# Altium schematic sheet SCH_Smart_Door.SchDoc
size B; SheetNumber: 1; SheetTotal: 1
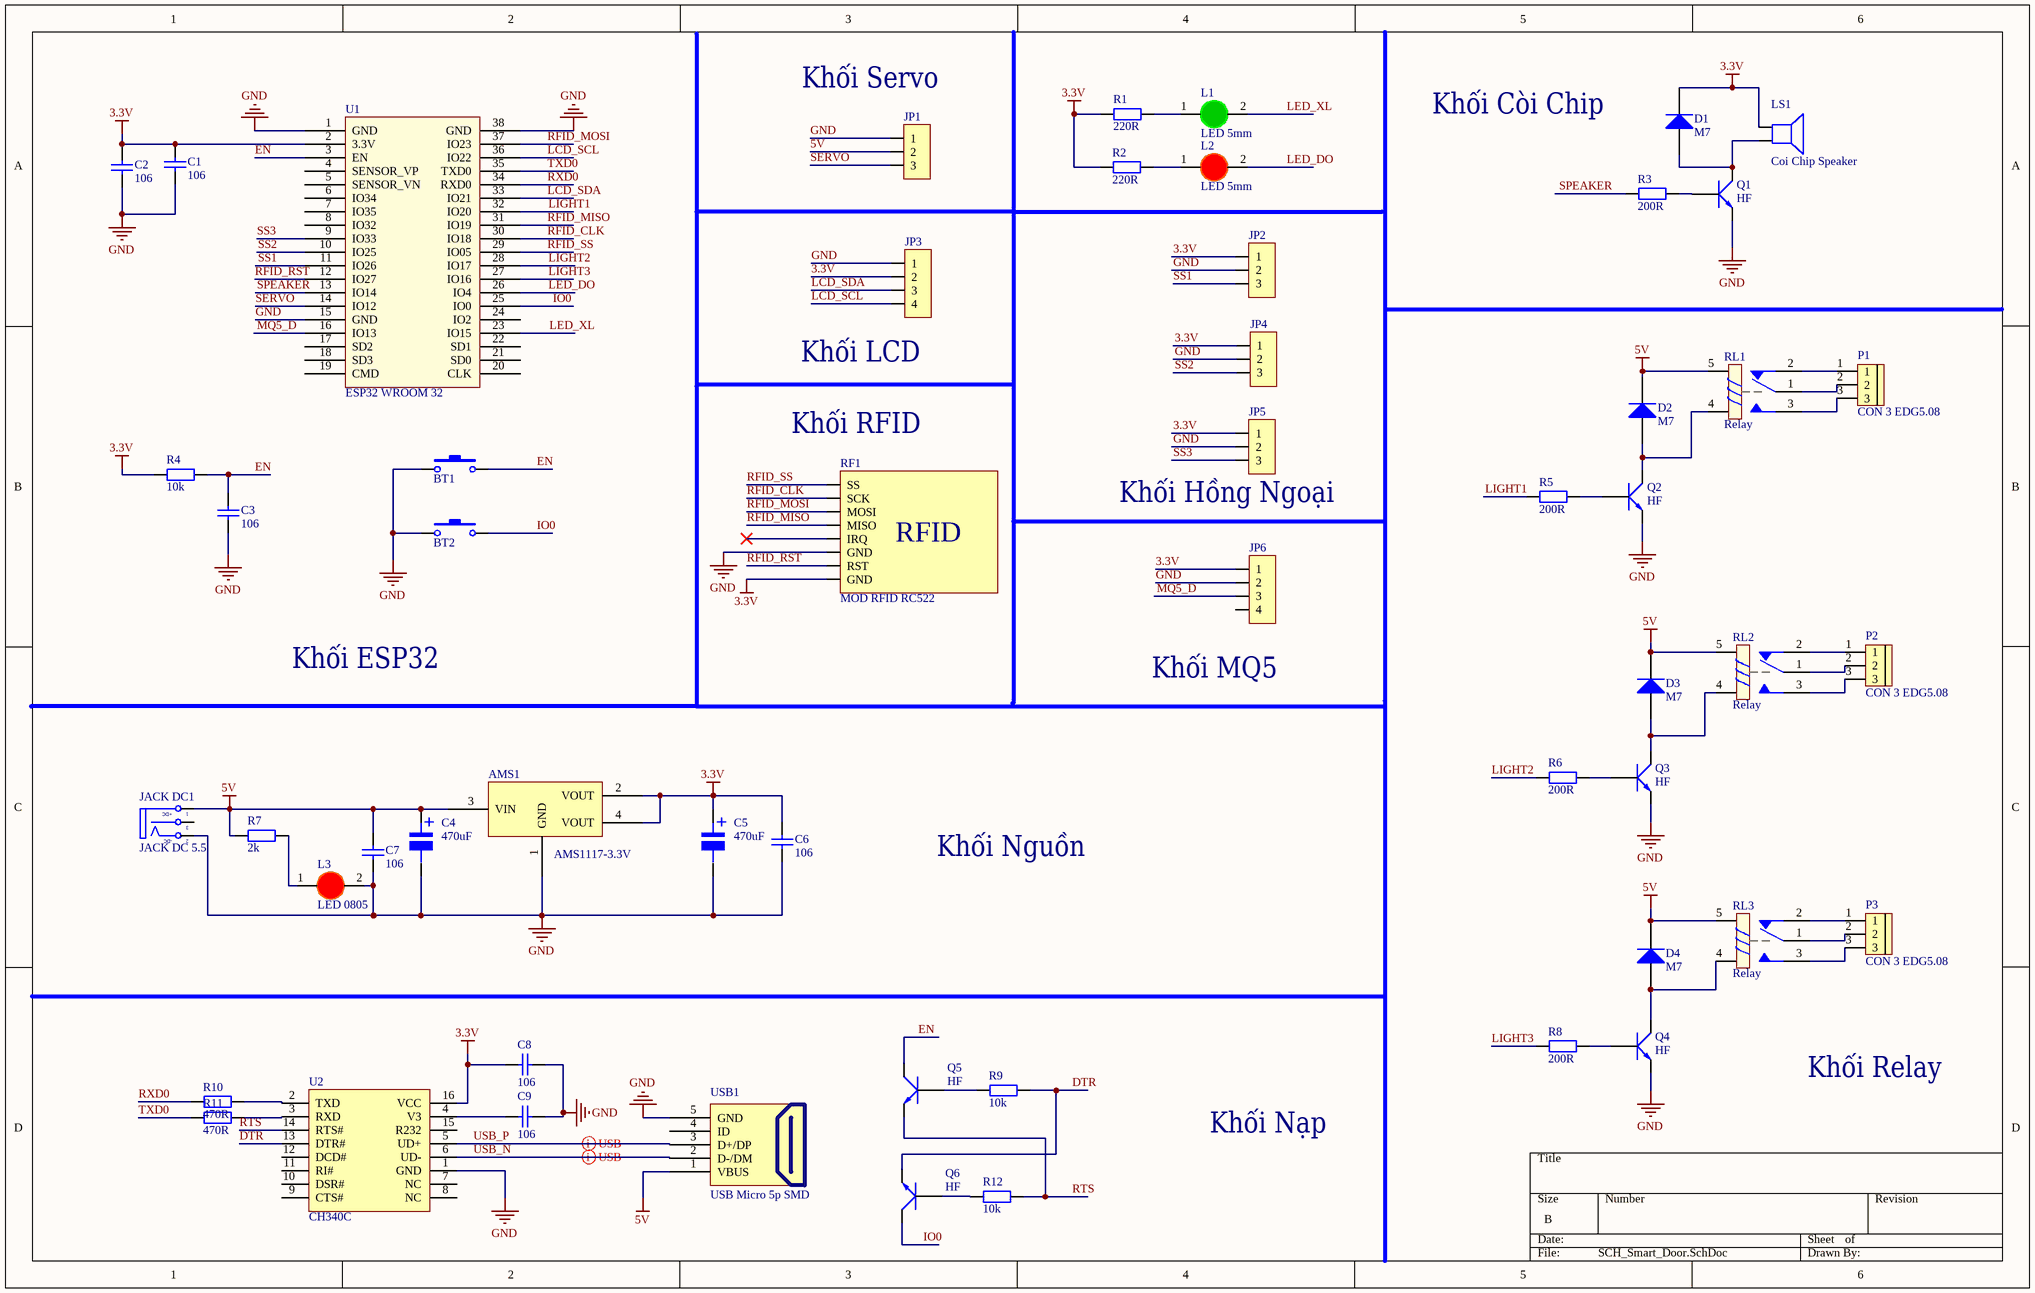
[diagram p0: SCH_Smart_Door.SchDoc]

## Parts
AMS1  AMS1117-3.3V  [SOT223]
BT1  Nut Nhan 2 Chan SMD 3x6x2.5  [Nut Nhan 2 Chan SMD 3x6x2.5]  (value not drawn)
BT2  Nut Nhan 2 Chan SMD 3x6x2.5  [Nut Nhan 2 Chan SMD 3x6x2.5]  (value not drawn)
C1  106  [tu 0805]
C2  106  [tu 0805]
C3  106  [tu 0805]
C4  470uF  [tu nhom 8 (f)]
C5  470uF  [tu nhom 8 (f)]
C6  106  [tu 0805]
C7  106  [tu 0805]
C8  106  [tu 0805]
C9  106  [tu 0805]
D1  M7  [DIODE SMA]
D2  M7  [DIODE SMA]
D3  M7  [DIODE SMA]
D4  M7  [DIODE SMA]
JACK_DC1  JACK DC 5.5  [JACK DC 5.5]
JP1  JP 1x3 2.54  [JP 1x3 DC]  (value not drawn)
JP2  JP 1x3 2.54  [JP 1x3 DT]  (value not drawn)
JP3  JP 1x4 2.54  [JP 1x4 DC]  (value not drawn)
JP4  JP 1x3 2.54  [JP 1x3 DT]  (value not drawn)
JP5  JP 1x3 2.54  [JP 1x3 DT]  (value not drawn)
JP6  JP 1x4 2.54  [JP 1x4 DC]  (value not drawn)
L1  LED 5mm  [LED-5MM-Green]
L2  LED 5mm  [LED-5MM-RED]
L3  LED 0805  [LED-0805-Red]
LS1  Coi Chip Speaker  [Coi Chip Speacker]
P1  CON 3 EDG5.08  [CON 3 3EDG5.08]
P2  CON 3 EDG5.08  [CON 3 3EDG5.08]
P3  CON 3 EDG5.08  [CON 3 3EDG5.08]
Q1  HF  [SOT23]
Q2  HF  [SOT23]
Q3  HF  [SOT23]
Q4  HF  [SOT23]
Q5  HF  [SOT23]
Q6  HF  [SOT23]
R1  220R  [tro smd 0805]
R2  220R  [tro smd 0805]
R3  200R  [tro smd 0805]
R4  10k  [tro smd 0805]
R5  200R  [tro smd 0805]
R6  200R  [tro smd 0805]
R7  2k  [Tro SMD 0805]
R8  200R  [tro smd 0805]
R9  10k  [tro smd 0805]
R10  470R  [Tro SMD 0805]
R11  470R  [Tro SMD 0805]
R12  10k  [tro smd 0805]
RF1  MOD RFID RC522  [MOD RFID RC522]
RL1  Relay  [Relay 5 Chan SRD]
RL2  Relay  [Relay 5 Chan SRD]
RL3  Relay  [Relay 5 Chan SRD]
U1  ESP32 WROOM 32  [ESP32-WROOM-32D]
U2  CH340C  [SOIC16_50_284_25X90_SMT]
USB1  USB Micro 5p SMD  [USB Micro 5p SMD]

## Nets
3.3V: AMS1.2(VOUT) AMS1.4(VOUT) C1.1 C2.1 C5.1 C6.1 C8.2 D1.2(K) JP2.1 JP3.2 JP4.1 JP5.1 JP6.1 LS1.1 R1.1 R2.1 R4.1 RF1.8(GND) U1.2(3.3V) U2.16(VCC)
5V: AMS1.3(VIN) C4.1 C7.1 D2.2(K) D3.2(K) D4.2(K) JACK_DC1.1(T) JP1.2 R7.1 RL1.5 RL2.5 RL3.5 USB1.1(VBUS)
GND: AMS1.1(GND) BT1.1 BT2.1 C1.2 C2.2 C3.2 C4.2 C5.2 C6.2 C7.2 C8.1 C9.1 JACK_DC1.2(TN) JP1.1 JP2.2 JP3.1 JP4.2 JP5.2 JP6.2 L3.2(K) Q1.2(E) Q2.2(E) Q3.2(E) Q4.2(E) RF1.6(GND) U1.1(GND) U1.15(GND) U1.38(GND) U2.1(GND) USB1.5(GND)
DTR: Q6.2(E) R9.2 U2.13(DTR#)
EN: BT1.2 C3.1 Q5.3(C) R4.2 U1.3(EN)
IO0: BT2.2 Q6.3(C) U1.25(IO0)
LCD_SCL: JP3.4 U1.36(IO22)
LCD_SDA: JP3.3 U1.33(IO21)
LED_DO: L2.2(K) U1.26(IO4)
LED_XL: L1.2(K) U1.23(IO15)
LIGHT1: R5.1 U1.32(IO20)
LIGHT2: R6.1 U1.28(IO17)
LIGHT3: R8.1 U1.27(IO16)
MQ5_D: JP6.3 U1.16(IO13)
RFID_CLK: RF1.2(SCK) U1.30(IO18)
RFID_MISO: RF1.4(MISO) U1.31(IO19)
RFID_MOSI: RF1.3(MOSI) U1.37(IO23)
RFID_RST: RF1.7(RST) U1.12(IO27)
RFID_SS: RF1.1(SS) U1.29(IO05)
RTS: Q5.2(E) R12.2 U2.14(RTS#)
RXD0: R10.1 U1.34(RXD0)
SERVO: JP1.3 U1.14(IO12)
SPEAKER: R3.1 U1.13(IO14)
SS1: JP2.3 U1.11(IO26)
SS2: JP4.3 U1.10(IO25)
SS3: JP5.3 U1.9(IO33)
TXD0: R11.1 U1.35(TXD0)
USB_N: U2.6(UD-) USB1.2(D-/DM)
USB_P: U2.5(UD+) USB1.3(D+/DP)
NetC9_2: C9.2 U2.4(V3)
NetD1_1: D1.1(A) LS1.2 Q1.3(C)
NetD2_1: D2.1(A) Q2.3(C) RL1.4
NetD3_1: D3.1(A) Q3.3(C) RL2.4
NetD4_1: D4.1(A) Q4.3(C) RL3.4
NetL1_1: L1.1(A) R1.2
NetL2_1: L2.1(A) R2.2
NetL3_1: L3.1(A) R7.2
NetP1_1: P1.1 RL1.2
NetP1_2: P1.2 RL1.1
NetP1_3: P1.3 RL1.3
NetP2_1: P2.1 RL2.2
NetP2_2: P2.2 RL2.1
NetP2_3: P2.3 RL2.3
NetP3_1: P3.1 RL3.2
NetP3_2: P3.2 RL3.1
NetP3_3: P3.3 RL3.3
NetQ1_1: Q1.1(B) R3.2
NetQ2_1: Q2.1(B) R5.2
NetQ3_1: Q3.1(B) R6.2
NetQ4_1: Q4.1(B) R8.2
NetQ5_1: Q5.1(B) R9.1
NetQ6_1: Q6.1(B) R12.1
NetR10_2: R10.2 U2.2(TXD)
NetR11_2: R11.2 U2.3(RXD)

Not connected (* = marked no-connect by the designer): JACK_DC1 3(S); JP6 4; RF1 5(IRQ)*; U1 4(SENSOR_VP) 5(SENSOR_VN) 6(IO34) 7(IO35) 8(IO32) 17(SD2) 18(SD3) 19(CMD) 20(CLK) 21(SD0) 22(SD1) 24(IO2); U2 7(NC) 8(NC) 9(CTS#) 10(DSR#) 11(RI#) 12(DCD#) 15(R232); USB1 4(ID)

## Layout directives
differential pair: USB_N, USB_P

## Notes on the sheet
- (near JP1) Khối Servo
- Khối Còi Chip
- (near JP3) Khối LCD
- (near RF1) Khối RFID
- (near JP5) Khối Hồng Ngoại
- Khối ESP32
- (near JP6) Khối MQ5
- Khối Nguồn
- Khối Relay
- Khối Nạp
- (in symbol JACK DC 5.5) +DC; -DC
- (in symbol MOD RFID RC522) RFID
- (in symbol Tu Nhom 470uF 16V) +

## Library data of the parts
AMS1 = AMS1117 SMD: Dán; Value: AMS1117-3.3V SOT223; Don_Vi: Con; Ma_Hang: MH000596; Ghi_Chu: *; Kieu_Chan: *; Chung_Loai: Dán
BT1 BT2 = Nut Nhan 2 Chan SMD 3x6x2.5: Ma_Hang: MH001036; Ten: Nút Nhấn 2 Chân 3x6x2.5MM SMD
C1-C3 C6-C9 = Tu 0805 106 16V 10%: Dán; Ten_Linh_Kien: Tụ 0805 106-10uF 10% 16V; So_Chan: 2; Don_Vi: Con; Ma_Hang: MH004553; Chung_Loai: Dán; Kieu_Chan: *
C4 C5 = Tu Nhom 470uF 16V: Dán; Don_Vi: Con; So_Chan: 2; Ten_Linh_Kien: Tụ Nhôm 470uF 16V 8x10.4MM; Ma_Hang: MH001940; Chung_Loai: Dán; Kieu_Chan: *
D1-D4 = Diode M7 ( 4007 ): Dán; Don_Vi: Con; Ten_Linh_Kien: Diode M7 1N4007 SMD 1A 1000V; Ma_Hang: MH000944; Chung_Loai: Dán; Ghi_Chu: *
JACK_DC1 = JACK DC 5.5: Value: Jac DC
JP1 = JP 1x3 2.54 Duc Cong: Cắm; Ten_Linh_Kien: Jump Đơn Đực 2.54MM 1x40P Cong Đứng; Don_Vi: Con; Ma_Hang: MH000904; Ghi_Chu: *; Kieu_Chan: *; Chung_Loai: Cắm
JP2 JP4 JP5 = JP 1x3 2.54 Duc Thang: Cắm; Ten_Linh_Kien: Jump Đơn Đực 2.54MM 1x40P Thẳng 11MM; Don_Vi: Con; Ma_Hang: MH000903; Ghi_Chu: *; Kieu_Chan: *; Chung_Loai: Cắm
JP3 JP6 = JP 1x4 2.54 Duc Cong: Cắm; Ten_Linh_Kien: Jump Đơn Đực 2.54MM 1x40P Cong Đứng; Don_Vi: Con; Ma_Hang: MH000904; Ghi_Chu: *; Kieu_Chan: *; Chung_Loai: Cắm
L1 = LED 5mm Xanh La: Cắm; Don_Vi: Con; Ma_Hang: MH008969; Ten_Linh_Kien: LED 5MM Phủ Xanh (1000c); Ghi_Chu: *; Kieu_Chan: *; Chung_Loai: Cắm
L2 = LED 5mm Do: Cắm; Don_Vi: Con; Ma_Hang: MH008967; Ten_Linh_Kien: Led 5MM Phủ Đỏ (1000c); Ghi_Chu: *; Kieu_Chan: *; Chung_Loai: Cắm
L3 = LED 0805 Do: Dán; Don_Vi: Con; Ma_Hang: MH000897; Ten_Linh_Kien: LED 0805 Màu Đỏ (Red); Ghi_Chu: *; Kieu_Chan: *; Chung_Loai: Dán
LS1 = Coi Chip Speaker: Còi chip
P1-P3 = CON 3 EDG5.08: Cắm; Ten_Linh_Kien: CON 3 2EDG5.08-3P 5.08MM ( Xanh Cong); Ma_Hang: MH000760; Ghi_Chu: *; Kieu_Chan: *; Don_Vi: Con; Chung_Loai: Cắm
Q1-Q6 = C1815 HF SMD: NPN transistor; Value: C9014
R1 R2 = Tro 0805 5% 220R: Dán; Don_Vi: Con; So_Chan: 2; Ten_Linh_Kien: Trở 0805 5% 220R; Ma_Hang: MH005259; Chung_Loai: Dán; Kieu_Chan: *
R3 R5 R6 R8 = Tro 0805 5% 200R: Dán; Don_Vi: Con; So_Chan: 2; Ten_Linh_Kien: Trở 0805 5% 200R; Ma_Hang: MH005257; Chung_Loai: Dán; Kieu_Chan: *
R4 R9 R12 = Tro 0805 5% 10k: Dán; Don_Vi: Con; So_Chan: 2; Ten_Linh_Kien: Trở 0805 5% 10k; Ma_Hang: MH005239; Chung_Loai: Dán; Kieu_Chan: *
R7 = Tro 0805 5% 2k: Dán; Don_Vi: Con; So_Chan: 2; Ten_Linh_Kien: Trở 0805 5% 2k; Ma_Hang: MH005304; Chung_Loai: Dán; Kieu_Chan: *
R10 R11 = Tro 0805 5% 470R: Dán; Don_Vi: Con; Ma_Hang: MH005341; Ten_Linh_Kien: Trở 0805 5% 470R; So_Chan: 2; Chung_Loai: Dán; Kieu_Chan: *
RL1-RL3 = Relay 5 Chan SRD: Relay 5 Chan; Ma_Hang: MH009374; Ten: Relay 5V10A SRD-05VDC-SL-C Chính Hãng
U2 = CH340C: USB Bridge, USB to UART USB 2.0 UART Interface; Manufacturer: Olimex; Alternate Part Number-1: NA; Manufacturer Part Number: CH340C; Case/Package: SOIC16; Supplier-1: LCSC; Supplier Part Number-1: C84681
USB1 = USB Micro 5p SMD: USB Type B; Ten: MicroUSB MK5P SMD; Ma_Hang: MH001020